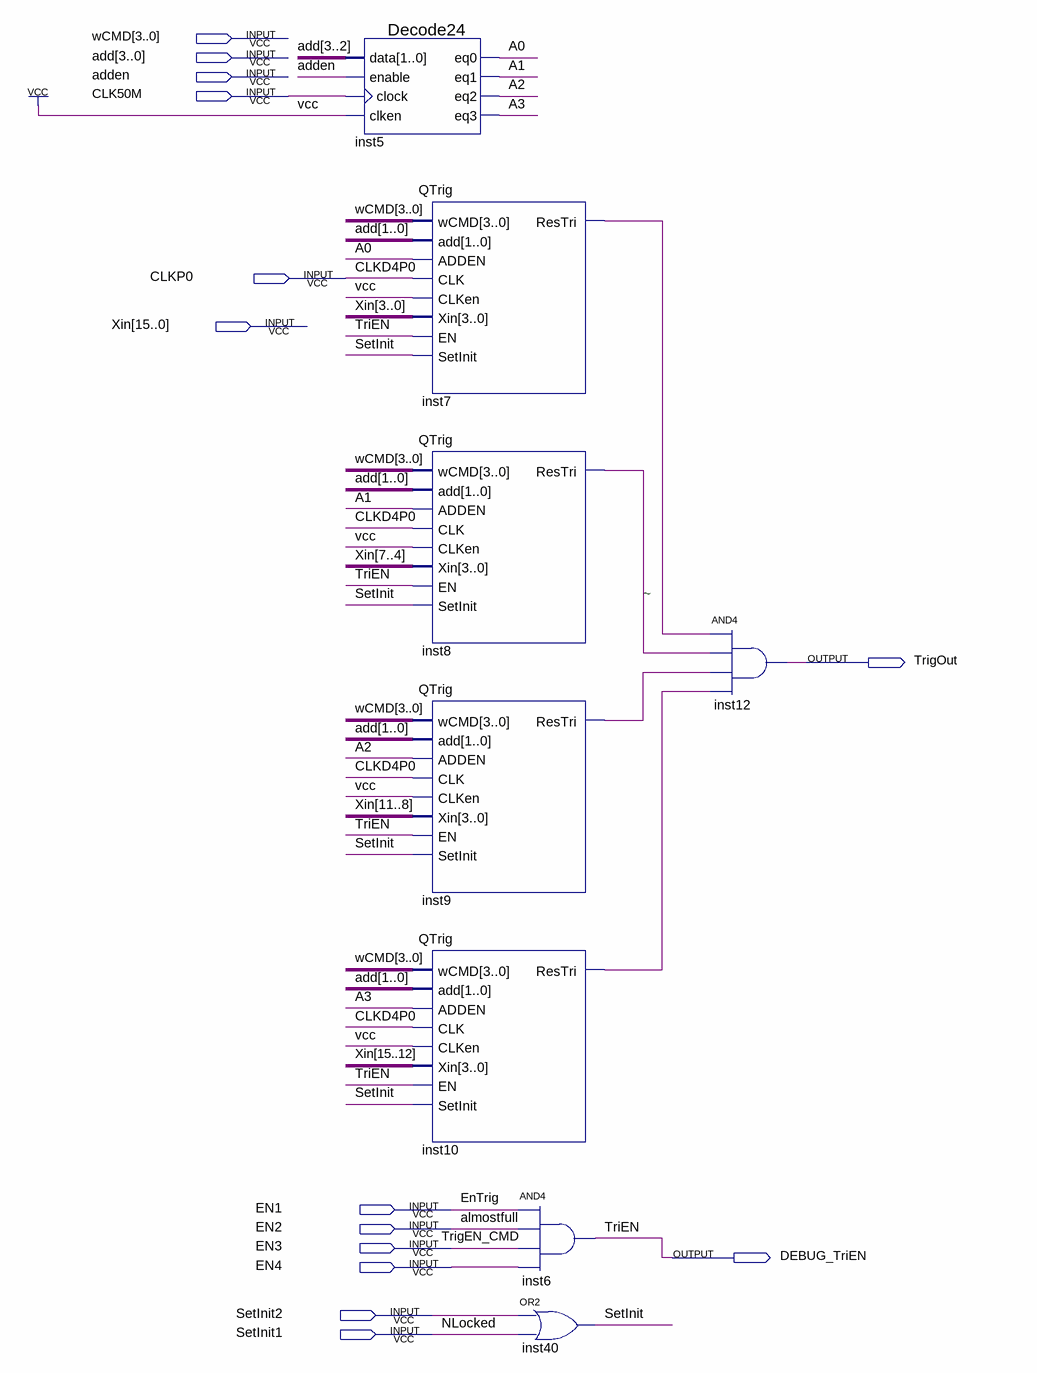
[diagram p0: schematic sheet]
// Quartus schematic 16Trig.bdf as structural Verilog: 8 symbols, 14 pins
module \16Trig  (
  input  [3:0] wCMD,
  input  [3:0] add,
  input  adden,
  input  CLK50M,
  input  CLKP0,
  input  [15:0] Xin,
  input  EN1,
  input  EN2,
  input  EN3,
  input  EN4,
  input  SetInit2,
  input  SetInit1,
  output TrigOut,
  output DEBUG_TriEN
);

  wire A0, A1, A2, A3, inst7_restri, inst8_restri, inst9_restri, inst10_restri, SetInit;

  Decode24 inst5 (
    .data(add[3:2]), .enable(adden), .clock(CLK50M), .clken(1'b1), .eq0(A0), .eq1(A1), .eq2(A2), .eq3(A3));
  QTrig inst7 (
    .wCMD(wCMD), .add(add[1:0]), .ADDEN(A0), .CLK(CLKP0), .CLKen(1'b1), .Xin(Xin[3:0]), .EN(DEBUG_TriEN),
    .SetInit(SetInit), .ResTri(inst7_restri));
  QTrig inst8 (
    .wCMD(wCMD), .add(add[1:0]), .ADDEN(A1), .CLK(CLKP0), .CLKen(1'b1), .Xin(Xin[7:4]), .EN(DEBUG_TriEN),
    .SetInit(SetInit), .ResTri(inst8_restri));
  QTrig inst9 (
    .wCMD(wCMD), .add(add[1:0]), .ADDEN(A2), .CLK(CLKP0), .CLKen(1'b1), .Xin(Xin[11:8]), .EN(DEBUG_TriEN),
    .SetInit(SetInit), .ResTri(inst9_restri));
  QTrig inst10 (
    .wCMD(wCMD), .add(add[1:0]), .ADDEN(A3), .CLK(CLKP0), .CLKen(1'b1), .Xin(Xin[15:12]), .EN(DEBUG_TriEN),
    .SetInit(SetInit), .ResTri(inst10_restri));
  and inst6 (DEBUG_TriEN, EN1, EN2, EN3, EN4);
  or inst40 (SetInit, SetInit2, SetInit1);
  and inst12 (TrigOut, inst7_restri, inst8_restri, inst9_restri, inst10_restri);

  // Other names for the same wires on the sheet: almostfull = EN2; CLKD4P0 = CLKP0; TriEN = DEBUG_TriEN; EnTrig = EN1;
  //   NLocked = SetInit1; TrigEN_CMD = EN3

  // Notes on the sheet:
  //   ~
endmodule
